# Altium schematic sheet Sensors.SchDoc
size A
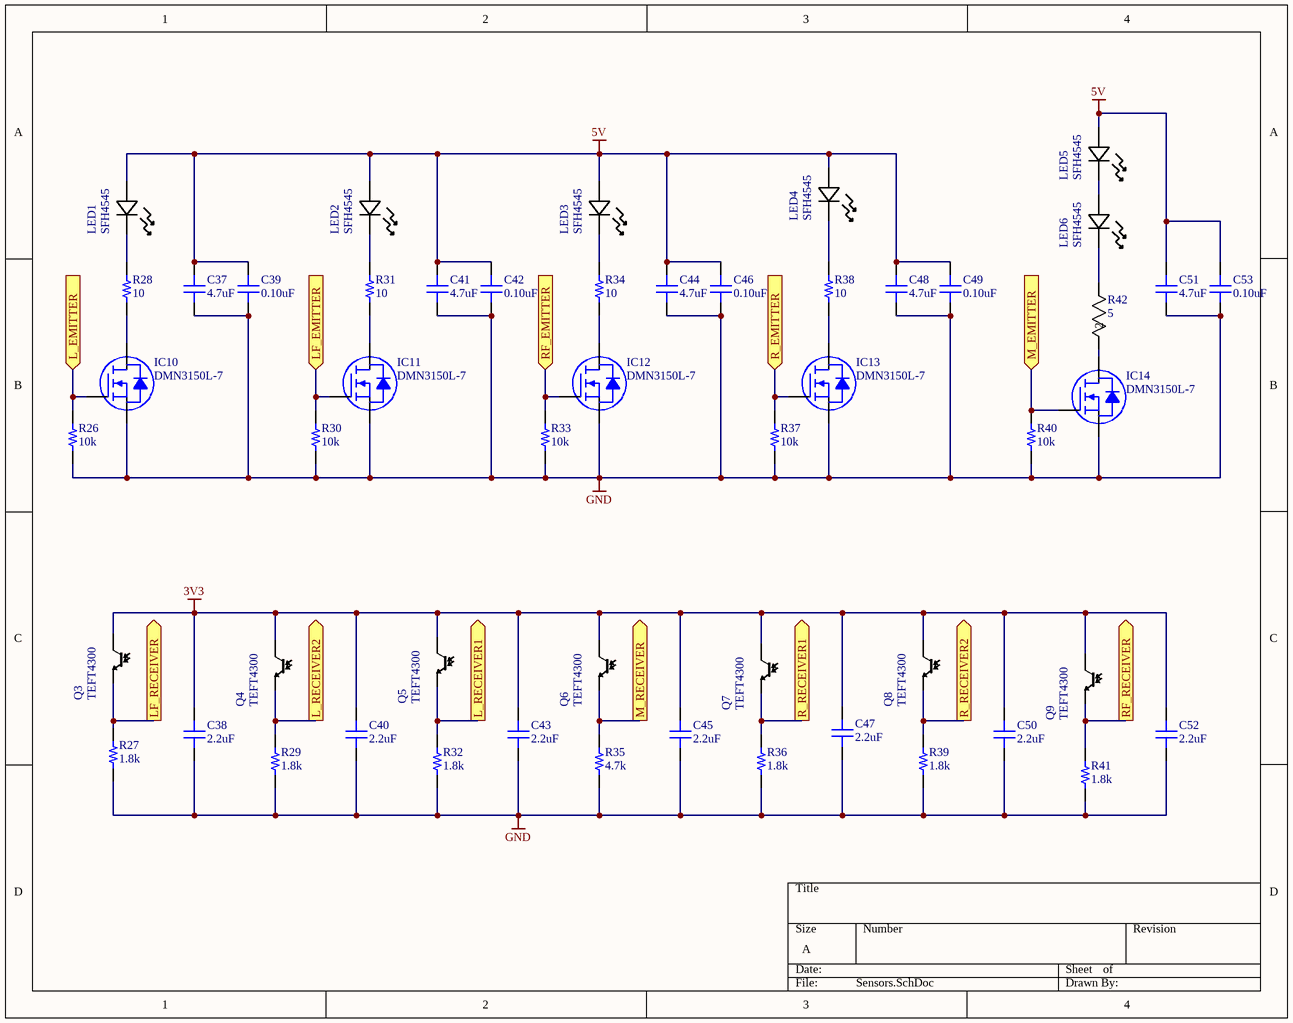
[diagram p0: Sensors.SchDoc]

## Parts
C37  4.7uF  [CAP 0805/2012]
C38  2.2uF  [CAP 0402/1005]
C39  0.10uF  [CAP 0603/1608]
C40  2.2uF  [CAP 0402/1005]
C41  4.7uF  [CAP 0805/2012]
C42  0.10uF  [CAP 0603/1608]
C43  2.2uF  [CAP 0402/1005]
C44  4.7uF  [CAP 0805/2012]
C45  2.2uF  [CAP 0402/1005]
C46  0.10uF  [CAP 0603/1608]
C47  2.2uF  [CAP 0402/1005]
C48  4.7uF  [CAP 0805/2012]
C49  0.10uF  [CAP 0603/1608]
C50  2.2uF  [CAP 0402/1005]
C51  4.7uF  [CAP 0805/2012]
C52  2.2uF  [CAP 0402/1005]
C53  0.10uF  [CAP 0603/1608]
IC10  DMN3150L-7  [DIODES SOT-23-3]
IC11  DMN3150L-7  [DIODES SOT-23-3]
IC12  DMN3150L-7  [DIODES SOT-23-3]
IC13  DMN3150L-7  [DIODES SOT-23-3]
IC14  DMN3150L-7  [DIODES SOT-23-3]
LED1  SFH4545  [LED_TLH]
LED2  SFH4545  [LED_TLH]
LED3  SFH4545  [LED_TLH]
LED4  SFH4545  [LED_TLH]
LED5  SFH4545  [LED_TLH]
LED6  SFH4545  [LED_TLH]
Q3  TEFT4300  [LED_TLH]
Q4  TEFT4300  [LED_TLH]
Q5  TEFT4300  [LED_TLH]
Q6  TEFT4300  [LED_TLH]
Q7  TEFT4300  [LED_TLH]
Q8  TEFT4300  [LED_TLH]
Q9  TEFT4300  [LED_TLH]
R26  10k  [RES 0402/1005]
R27  1.8k  [RES 0402/1005]
R28  10  [RES 0603/1608]
R29  1.8k  [RES 0402/1005]
R30  10k  [RES 0402/1005]
R31  10  [RES 0603/1608]
R32  1.8k  [RES 0402/1005]
R33  10k  [RES 0402/1005]
R34  10  [RES 0603/1608]
R35  4.7k  [RES 0402/1005]
R36  1.8k  [RES 0402/1005]
R37  10k  [RES 0402/1005]
R38  10  [RES 0603/1608]
R39  1.8k  [RES 0402/1005]
R40  10k  [RES 0402/1005]
R41  1.8k  [RES 0402/1005]
R42  5  [RES_WSC_2515]

## Ports
L_EMITTER (in), L_RECEIVER1 (out), L_RECEIVER2 (out), LF_EMITTER (in), LF_RECEIVER (out), M_EMITTER (in), M_RECEIVER (out), R_EMITTER (in), R_RECEIVER1 (out), R_RECEIVER2 (out), RF_EMITTER (in), RF_RECEIVER (out)

## Nets
3V3: C38.1 C40.1 C43.1 C45.1 C47.1 C50.1 C52.1 Q3.2 Q4.2 Q5.2 Q6.2 Q7.2 Q8.2 Q9.2
5V: C37.2 C39.2 C41.2 C42.2 C44.2 C46.2 C48.2 C49.2 C51.2 C53.2 LED1.2 LED2.2 LED3.2 LED4.2 LED5.2
GND: C37.1 C38.2 C39.1 C40.2 C41.1 C42.1 C43.2 C44.1 C45.2 C46.1 C47.2 C48.1 C49.1 C50.2 C51.1 C52.2 C53.1 IC10.3(S) IC11.3(S) IC12.3(S) IC13.3(S) IC14.3(S) R26.1 R27.1 R29.1 R30.1 R32.1 R33.1 R35.1 R36.1 R37.1 R39.1 R40.1 R41.1
L_EMITTER: IC10.1(G) R26.2 ; port L_EMITTER
L_RECEIVER1: Q5.1 R32.2 ; port L_RECEIVER1
L_RECEIVER2: Q4.1 R29.2 ; port L_RECEIVER2
LF_EMITTER: IC11.1(G) R30.2 ; port LF_EMITTER
LF_RECEIVER: Q3.1 R27.2 ; port LF_RECEIVER
M_EMITTER: IC14.1(G) R40.2 ; port M_EMITTER
M_RECEIVER: Q6.1 R35.2 ; port M_RECEIVER
R_EMITTER: IC13.1(G) R37.2 ; port R_EMITTER
R_RECEIVER1: Q7.1 R36.2 ; port R_RECEIVER1
R_RECEIVER2: Q8.1 R39.2 ; port R_RECEIVER2
RF_EMITTER: IC12.1(G) R33.2 ; port RF_EMITTER
RF_RECEIVER: Q9.1 R41.2 ; port RF_RECEIVER
NetIC10_2: IC10.2(D) R28.2
NetIC11_2: IC11.2(D) R31.2
NetIC12_2: IC12.2(D) R34.2
NetIC13_2: IC13.2(D) R38.2
NetIC14_2: IC14.2(D) R42.2
NetLED1_1: LED1.1 R28.1
NetLED2_1: LED2.1 R31.1
NetLED3_1: LED3.1 R34.1
NetLED4_1: LED4.1 R38.1
NetLED5_1: LED5.1 LED6.2
NetLED6_1: LED6.1 R42.1

## Library data of the parts
C37 C41 C44 C48 C51 = CC0805ZRY5V6BB475: CAP CER 4.7UF 10V Y5V 0805; Manufacturer: Yageo; TemperatureRange: -30C ~ 85C; TemperatureCoefficient: Y5V (F); Tolerance: -20%, +80%; Value: 4.7uF; Part Number: CC0805ZRY5V6BB475; PartId: 13806; Supplier 1: Digi-Key; Supplier Part Number 1: 311-1371-2-ND; ComponentLink1Description: Datasheet; ComponentLink1URL: http://www.yageo.com/documents/recent/UPY-GPHC_Y5V_6.3V-to-50V_6.pdf; ComponentLink2Description: Digi-Key Listing; ComponentLink2URL: https://www.digikey.com/product-detail/en/yageo/CC0805ZRY5V6BB475/311-1371-2-ND/2103109; Voltage: 10V; Price: 0.0145; Device Package: 0805 (2012 Metric)
C38 C40 C43 C45 C47 C50 C52 = CL05A225KP5NSNC: CAP CER 2.2UF 10V X5R 0402; Manufacturer: Samsung Electro-Mechanics America, Inc.; TemperatureRange: -55C ~ 85C; Tolerance: 10%; Value: 2.2uF; Part Number: CL05A225KP5NSNC; PartId: 12898; Supplier 1: Digi-Key; Supplier Part Number 1: 1276-1108-2-ND; ComponentLink1Description: Datasheet; ComponentLink1URL: http://www.samsungsem.com/kr/support/product-search/mlcc/CL05A225KP5NSNC.jsp; ComponentLink2Description: Digi-Key Listing; ComponentLink2URL: https://www.digikey.com/product-detail/en/samsung-electro-mechanics-america-inc/CL05A225KP5NSNC/1276-1108-2-ND/3886766; TemperatureCoefficient: X5R; Voltage: 10V; Price: 0.0612; Device Package: 0402 (1005 Metric)
C39 C42 C46 C49 C53 = CC0603ZRY5V8BB104: CAP CER 0.1UF 25V Y5V 0603; Manufacturer: Yageo; TemperatureRange: -30C ~ 85C; TemperatureCoefficient: Y5V (F); Tolerance: -20%, +80%; Value: 0.10uF; Part Number: CC0603ZRY5V8BB104; PartId: 13480; Supplier 1: Digi-Key; Supplier Part Number 1: 311-1087-2-ND; ComponentLink1Description: Datasheet; ComponentLink1URL: http://www.yageo.com/documents/recent/UPY-GPHC_Y5V_6.3V-to-50V_6.pdf; ComponentLink2Description: Digi-Key Listing; ComponentLink2URL: https://www.digikey.com/product-detail/en/yageo/CC0603ZRY5V8BB104/311-1087-2-ND/302821; Voltage: 25V; Price: 0.0036; Device Package: 0603 (1608 Metric)
IC10-IC14 = DMN3150L-7: MOSFET N-CH 28V 3.2A SOT23-3; Manufacturer: Diodes Incorporated; Rds On (Max) at Id, Vgs: 85 mOhm @ 3.6A, 4.5V; Vgs(th) (Max) at Id: 12V; Input Capacitance (Ciss) at Vds: 305pF @ 5V; Current Continuous Drain: 3.8A (Ta); Part Number: DMN3150L-7; PartId: 29528; Supplier 1: Digi-Key; Supplier Part Number 1: DMN3150LDICT-ND; ComponentLink1Description: Datasheet; ComponentLink1URL: http://www.diodes.com/_files/datasheets/ds31126.pdf; ComponentLink2Description: Digi-Key Listing; ComponentLink2URL: https://www.digikey.com/product-detail/en/diodes-incorporated/DMN3150L-7/DMN3150LDICT-ND/1774236; Price: 0.62; Type: N-Channel; Device Package: TO-236-3, SC-59, SOT-23-3; Drain to Source Voltage (Vdss): 28V
LED1-LED6 = SFH4545: Imported; Vendor: Vishay; Built_By: EMA_UL_Team; Type: DEV; C: Copyright (C) 2015 Accelerated Designs. All rights reserved; Manufacturer_Part_Number: SFH4545; RefDes: RefDes; Value: Value; Part Number: SFH4545
Q3-Q9 = TEFT4300: Imported; Vendor: Vishay; Built_By: EMA_UL_Team; Type: DEV; C: Copyright (C) 2015 Accelerated Designs. All rights reserved; Manufacturer_Part_Number: TEFT4300; RefDes: RefDes; Value: Value
R26 R30 R33 R37 R40 = RC0402JR-0710KL: RES SMD 10K OHM 5% 1/16W 0402; Manufacturer: Yageo; TemperatureRange: -55C ~ 155C; TemperatureCoefficient: 100ppm/C; PowerRating: 0.063W, 1/16W; Value: 10k; Part Number: RC0402JR-0710KL; PartId: 14464; Supplier 1: Digi-Key; Supplier Part Number 1: 311-10KJRTR-ND; ComponentLink1Description: Datasheet; ComponentLink1URL: http://www.yageo.com/documents/recent/PYu-RC_Group_51_RoHS_L_04.pdf; ComponentLink2Description: Digi-Key Listing; ComponentLink2URL: https://www.digikey.com/product-detail/en/yageo/RC0402JR-0710KL/311-10KJRTR-ND/726418; Tolerance: 5%; Price: 0.0017; Device Package: 0402 (1005 Metric)
R27 R29 R32 R36 R39 R41 = RC0402JR-071K8L: RES SMD 1.8K OHM 5% 1/16W 0402; Manufacturer: Yageo; TemperatureRange: -55C ~ 155C; TemperatureCoefficient: 100ppm/C; PowerRating: 0.063W, 1/16W; Value: 1.8k; Part Number: RC0402JR-071K8L; PartId: 14530; Supplier 1: Digi-Key; Supplier Part Number 1: 311-1.8KJRTR-ND; ComponentLink1Description: Datasheet; ComponentLink1URL: http://www.yageo.com/documents/recent/PYu-RC_Group_51_RoHS_L_04.pdf; ComponentLink2Description: Digi-Key Listing; ComponentLink2URL: https://www.digikey.com/product-detail/en/yageo/RC0402JR-071K8L/311-1.8KJRTR-ND/726414; Tolerance: 5%; Price: 0.0017; Device Package: 0402 (1005 Metric)
R28 R31 R34 R38 = ERJ-3EKF4701V: RES SMD 4.7K OHM 1% 1/10W 0603; Part Number: RK73B1JTTDD100J; TemperatureRange: -55C ~ 155C; TemperatureCoefficient: 100ppm/C; PowerRating: 0.125W(1/8W); Value: 10; PartId: 890; Supplier 1: Digi-Key; ComponentLink1Description: Datasheet; ComponentLink1URL: http://industrial.panasonic.com/www-cgi/jvcr13pz.cgi?E+PZ+3+AOA0002+ERJ3EKF4701V+7+WW; ComponentLink2Description: Digi-Key listing; ComponentLink2URL: http://digikey.com/product-detail/en/ERJ-3EKF4701V/P4.70KHTR-ND/1746419; Tolerance: 1%; Price: 0.0038; Type: Thick Film; Device Package: 0603 (1608 Metric)
R35 = RC0402JR-074K7L: RES SMD 4.7K OHM 5% 1/16W 0402; Manufacturer: Yageo; TemperatureRange: -55C ~ 155C; TemperatureCoefficient: 100ppm/C; PowerRating: 0.063W, 1/16W; Value: 4.7k; Part Number: RC0402JR-074K7L; PartId: 14466; Supplier 1: Digi-Key; Supplier Part Number 1: 311-4.7KJRTR-ND; ComponentLink1Description: Datasheet; ComponentLink1URL: http://www.yageo.com/documents/recent/PYu-RC_Group_51_RoHS_L_04.pdf; ComponentLink2Description: Digi-Key Listing; ComponentLink2URL: https://www.digikey.com/product-detail/en/yageo/RC0402JR-074K7L/311-4.7KJRTR-ND/726477; Tolerance: 5%; Price: 0.0017; Device Package: 0402 (1005 Metric)
R42 = WSC25155R000FEA: No Description Available; Vendor: Vishay; Built_By: EMA_UL_Team; Manufacturer_Part_Number: WSC25155R000FEA; Copyright: Copyright (C) 2018 Accelerated Designs. All rights reserved; RefDes: RefDes; Type: DEV; Value: 5